# EAGLE design pure_class_a_dynamic (EAGLE 5.07)
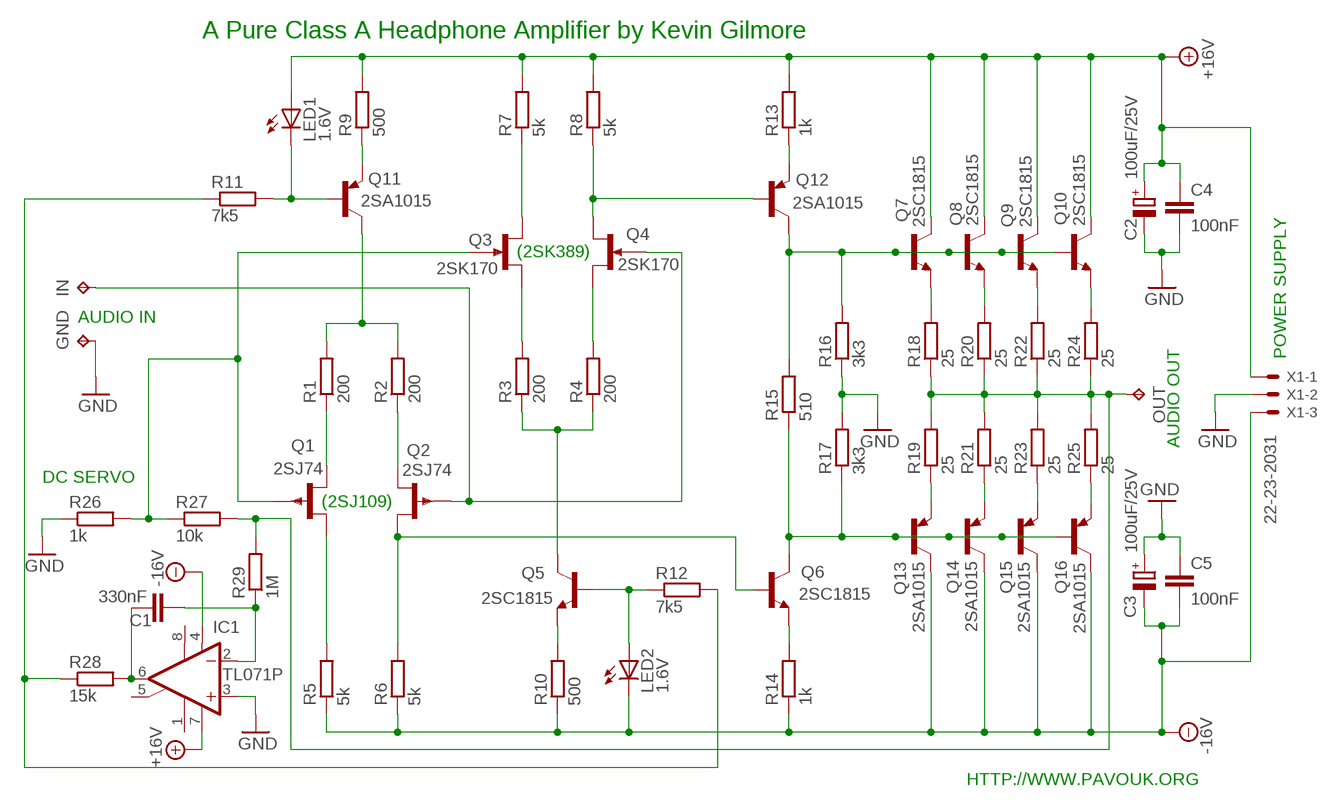
[diagram p0: schematic, sheet 1]

## Parts
C1  330nF  C-EU050-055X075  [C050-055X075]
C2  100uF/25V  CPOL-EUE3.5-8  [E3,5-8]
C3  100uF/25V  CPOL-EUE3.5-8  [E3,5-8]
C4  100nF  C-EU050-035X075  [C050-035X075]
C5  100nF  C-EU050-035X075  [C050-035X075]
GND  TPPAD1-20  [P1-20]
IC1  TL071P  [DIL08]
IN  TPPAD1-20  [P1-20]
LED1  1.6V  LEDSFH480  [SFH480]
LED2  1.6V  LEDSFH480  [SFH480]
OUT  TPPAD1-20  [P1-20]
Q1  2SJ74  2N3820  [TO92F]
Q2  2SJ74  2N3820  [TO92F]
Q3  2SK170  2N3819  [TO92F]
Q4  2SK170  2N3819  [TO92F]
Q5  2SC1815  [TO92-ECB]
Q6  2SC1815  [TO92-ECB]
Q7  2SC1815  [TO92-ECB]
Q8  2SC1815  [TO92-ECB]
Q9  2SC1815  [TO92-ECB]
Q10  2SC1815  [TO92-ECB]
Q11  2SA1015  -PNP-TO92-ECB  [TO92-ECB]
Q12  2SA1015  -PNP-TO92-ECB  [TO92-ECB]
Q13  2SA1015  -PNP-TO92-ECB  [TO92-ECB]
Q14  2SA1015  -PNP-TO92-ECB  [TO92-ECB]
Q15  2SA1015  -PNP-TO92-ECB  [TO92-ECB]
Q16  2SA1015  -PNP-TO92-ECB  [TO92-ECB]
R1  200  R-EU_0207/10  [0207/10]
R2  200  R-EU_0207/10  [0207/10]
R3  200  R-EU_0207/10  [0207/10]
R4  200  R-EU_0207/10  [0207/10]
R5  5k  R-EU_0207/10  [0207/10]
R6  5k  R-EU_0207/10  [0207/10]
R7  5k  R-EU_0207/10  [0207/10]
R8  5k  R-EU_0207/10  [0207/10]
R9  500  R-EU_0207/10  [0207/10]
R10  500  R-EU_0207/10  [0207/10]
R11  7k5  R-EU_0207/10  [0207/10]
R12  7k5  R-EU_0207/10  [0207/10]
R13  1k  R-EU_0207/10  [0207/10]
R14  1k  R-EU_0207/10  [0207/10]
R15  510  R-EU_0207/10  [0207/10]
R16  3k3  R-EU_0207/10  [0207/10]
R17  3k3  R-EU_0207/10  [0207/10]
R18  25  R-EU_0207/10  [0207/10]
R19  25  R-EU_0207/10  [0207/10]
R20  25  R-EU_0207/10  [0207/10]
R21  25  R-EU_0207/10  [0207/10]
R22  25  R-EU_0207/10  [0207/10]
R23  25  R-EU_0207/10  [0207/10]
R24  25  R-EU_0207/10  [0207/10]
R25  25  R-EU_0207/10  [0207/10]
R26  1k  R-EU_0207/10  [0207/10]
R27  10k  R-EU_0207/10  [0207/10]
R28  15k  R-EU_0207/10  [0207/10]
R29  1M  R-EU_0207/10  [0207/10]
X1  22-23-2031  [22-23-2031]

## Nets
+15V: C2.+ C4.1 IC1.7(V+) LED1.A Q7.C Q8.C Q9.C Q10.C R7.2 R8.2 R9.2 R13.2 X1.1 ; supply symbol labelled +16V
-15V: C3.- C5.2 IC1.4(V-) LED2.K(C) Q13.C Q14.C Q15.C Q16.C R5.1 R6.1 R10.1 R14.1 X1.3 ; supply symbol labelled -16V
GND: C2.- C3.+ C4.2 C5.1 GND.TP IC1.3(+IN) R16.1 R17.2 R26.1 X1.2
N$1: OUT.TP R18.1 R19.2 R20.1 R21.2 R22.1 R23.2 R24.1 R25.2 R27.2 R29.2
N$2: Q7.E R18.2
N$3: Q8.E R20.2
N$4: Q9.E R22.2
N$5: Q10.E R24.2
N$6: Q13.E R19.1
N$7: Q14.E R21.1
N$8: Q15.E R23.1
N$9: Q16.E R25.1
N$10: Q11.E R9.1
N$11: Q7.B Q8.B Q9.B Q10.B Q12.C R15.2 R16.2
N$12: LED1.K(C) Q11.B R11.2
N$13: Q6.C Q13.B Q14.B Q15.B Q16.B R15.1 R17.1
N$14: Q12.E R13.1
N$15: Q6.E R14.2
N$16: Q5.E R10.2
N$17: LED2.A Q5.B R12.1
N$18: Q5.C R3.1 R4.1
N$19: Q3.D R7.1
N$20: Q3.S R3.2
N$21: Q4.D R4.2
N$22: Q4.S Q12.B R8.1
N$23: Q1.D R1.1
N$24: Q2.D Q6.B R6.2
N$25: Q2.S R2.1
N$26: Q1.S R5.2
N$27: Q11.C R1.2 R2.2
N$28: Q1.G Q3.G R26.2 R27.1
N$29: IN.TP Q2.G Q4.G
N$30: C1.1 IC1.6(OUT) R28.2
N$32: C1.2 IC1.2(-IN) R29.1
N$34: R11.1 R12.2 R28.1
Unconnected: IC1.1(ON1) IC1.5(ON2) IC1.8(OPT)

## Notes on the sheet
- A Pure Class A Headphone Amplifier by Kevin Gilmore
- (2SK389)
- AUDIO IN
- POWER SUPPLY
- AUDIO OUT
- DC SERVO
- (2SJ109)
- HTTP://WWW.PAVOUK.ORG

## Library data of the parts
C1 C4 C5 = rcl:C-EU: CAPACITOR, European symbol
C2 C3 = rcl:CPOL-EU: POLARIZED CAPACITOR, European symbol
GND IN OUT = testpad:TP: Test pad
IC1 = linear:TL071: OP AMP
LED1 LED2 = led:LED: LED OSRAM: - CHIPLED LG R971, LG N971, LY N971, LG Q971, LY Q971, LO R971, LY R971 LH N974, LH R974 LS Q976, LO Q976, LY Q976 LO Q996 - Hyper CHIPLED LW Q18S LB Q993, LB Q99A, LB R99A - SideLED LS A670, LO A670, LY A670, LG A670, LP A670 LB A673, LV A673, LT A673, LW A673 LH A674 LY A675 LS A676, LA A676, LO A676, LY A676, LW A676 LS A679, LY A679, LG A679 - Hyper Micro SIDELED® LS Y876, LA Y876, LO Y876, LY Y876 LT Y87S - SmartLED LW L88C, LW L88S LB L89C, LB L89S, LG L890 LS L89K, LO L89K, LY L89K LS L896, LA L896, LO L896, LY L896 - TOPLED LS T670, LO T670, LY T670, LG T670, LP T670 LSG T670, LSP T670, LSY T670, LOP T670, LYG T670 LG T671, LOG T671, LSG T671 LB T673, LV T673, LT T673, LW T673 LH T674 LS T676, LA T676, LO T676, LY T676, LB T676, LH T676, LSB T676, LW T676 LB T67C, LV T67C, LT T67C, LS T67K, LO T67K, LY T67K, LW E67C LS E67B, LA E67B, LO E67B, LY E67B, LB E67C, LV E67C, LT E67C LW T67C LS T679, LY T679, LG T679 LS T770, LO T770, LY T770, LG T770, LP T770 LB T773, LV T773, LT T773, LW T773 LH T774 LS E675, LA E675, LY E675, LS T675 LS T776, LA T776, LO T776, LY T776, LB T776 LHGB T686 LT T68C, LB T68C - Hyper Mini TOPLED® LB M676 - Mini TOPLED Santana® LG M470 LS M47K, LO M47K, LY M47K Source: http://www.osram.convergy.de LUXEON: - LUMILED® LXK2-PW12-R00, LXK2-PW12-S00, LXK2-PW14-U00, LXK2-PW14-V00 LXK2-PM12-R00, LXK2-PM12-S00, LXK2-PM14-U00 LXK2-PE12-Q00, LXK2-PE12-R00, LXK2-PE12-S00, LXK2-PE14-T00, LXK2-PE14-U00 LXK2-PB12-K00, LXK2-PB12-L00, LXK2-PB12-M00, LXK2-PB14-N00, LXK2-PB14-P00, LXK2-PB14-Q00 LXK2-PR12-L00, LXK2-PR12-M00, LXK2-PR14-Q00, LXK2-PR14-R00 LXK2-PD12-Q00, LXK2-PD12-R00, LXK2-PD12-S00 LXK2-PH12-R00, LXK2-PH12-S00 LXK2-PL12-P00, LXK2-PL12-Q00, LXK2-PL12-R00 Source: www.luxeon.com KINGBRIGHT: KA-3528ASYC Source: www.kingbright.com
Q1 Q2 = transistor-small-signal:2N3820: P-CHANNEL FET
Q3 Q4 = transistor-small-signal:2N3819: N-CHANNEL FET
Q5-Q10 = transistor:2SC1815: NPN EPITAXIAL TRANSISTOR Source: TOSHIBA .. 2SC1815 1.pdf
Q11-Q16 = transistor-neu-to92:*-PNP-: PNP Transistror
R1-R29 = rcl:R-EU_: RESISTOR, European symbol
X1 = con-molex:22-23-2031: .100" (2.54mm) Center Header - 3 Pin

## Board
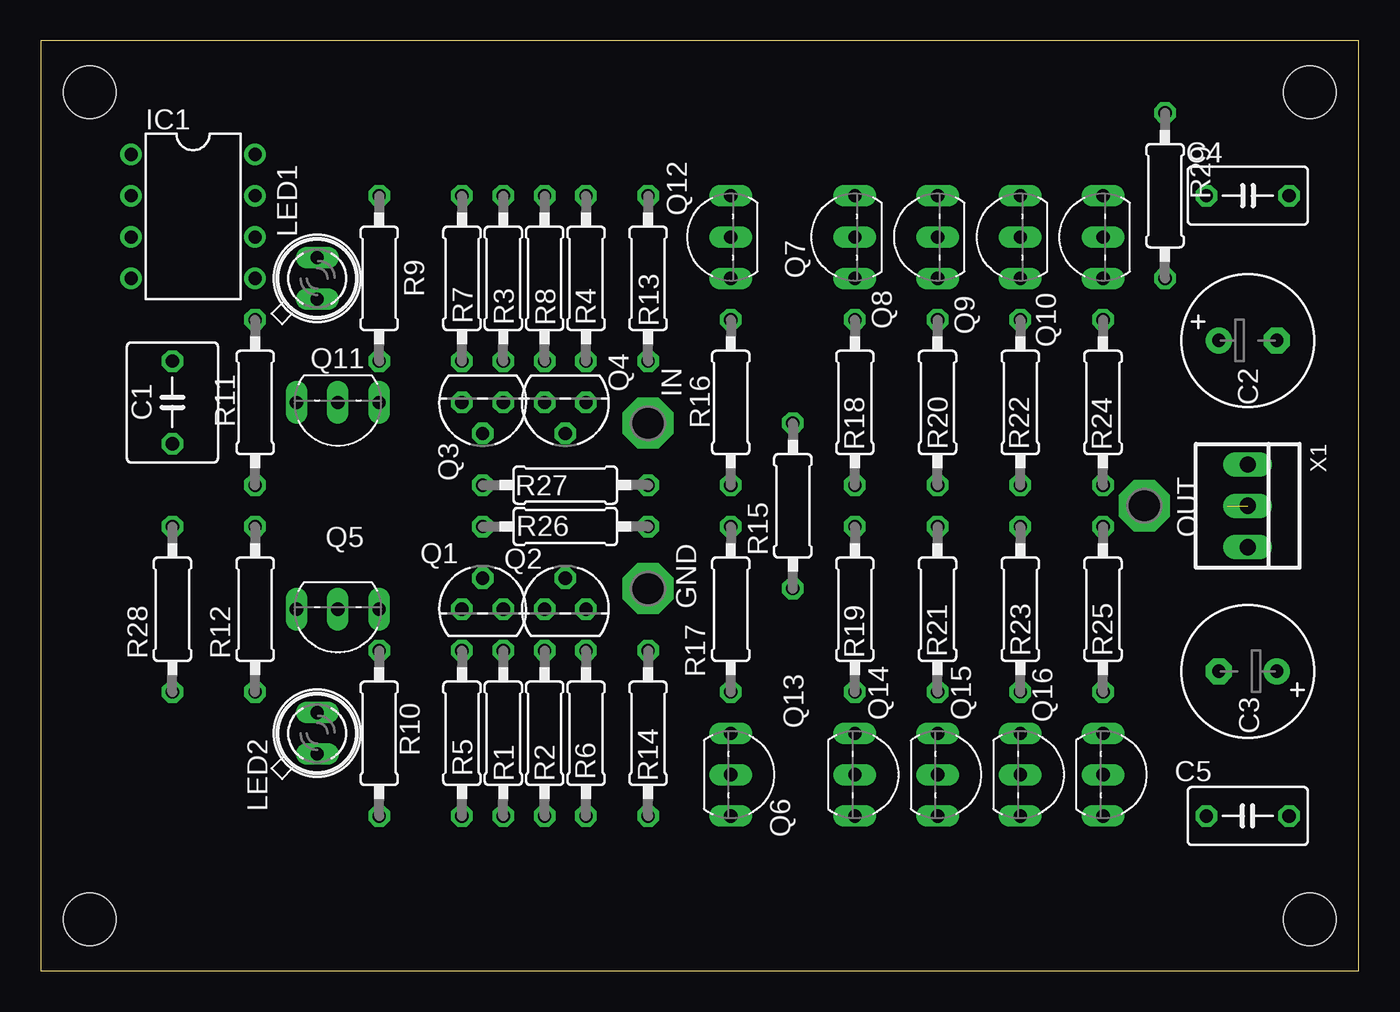
[diagram p1: board, top side]
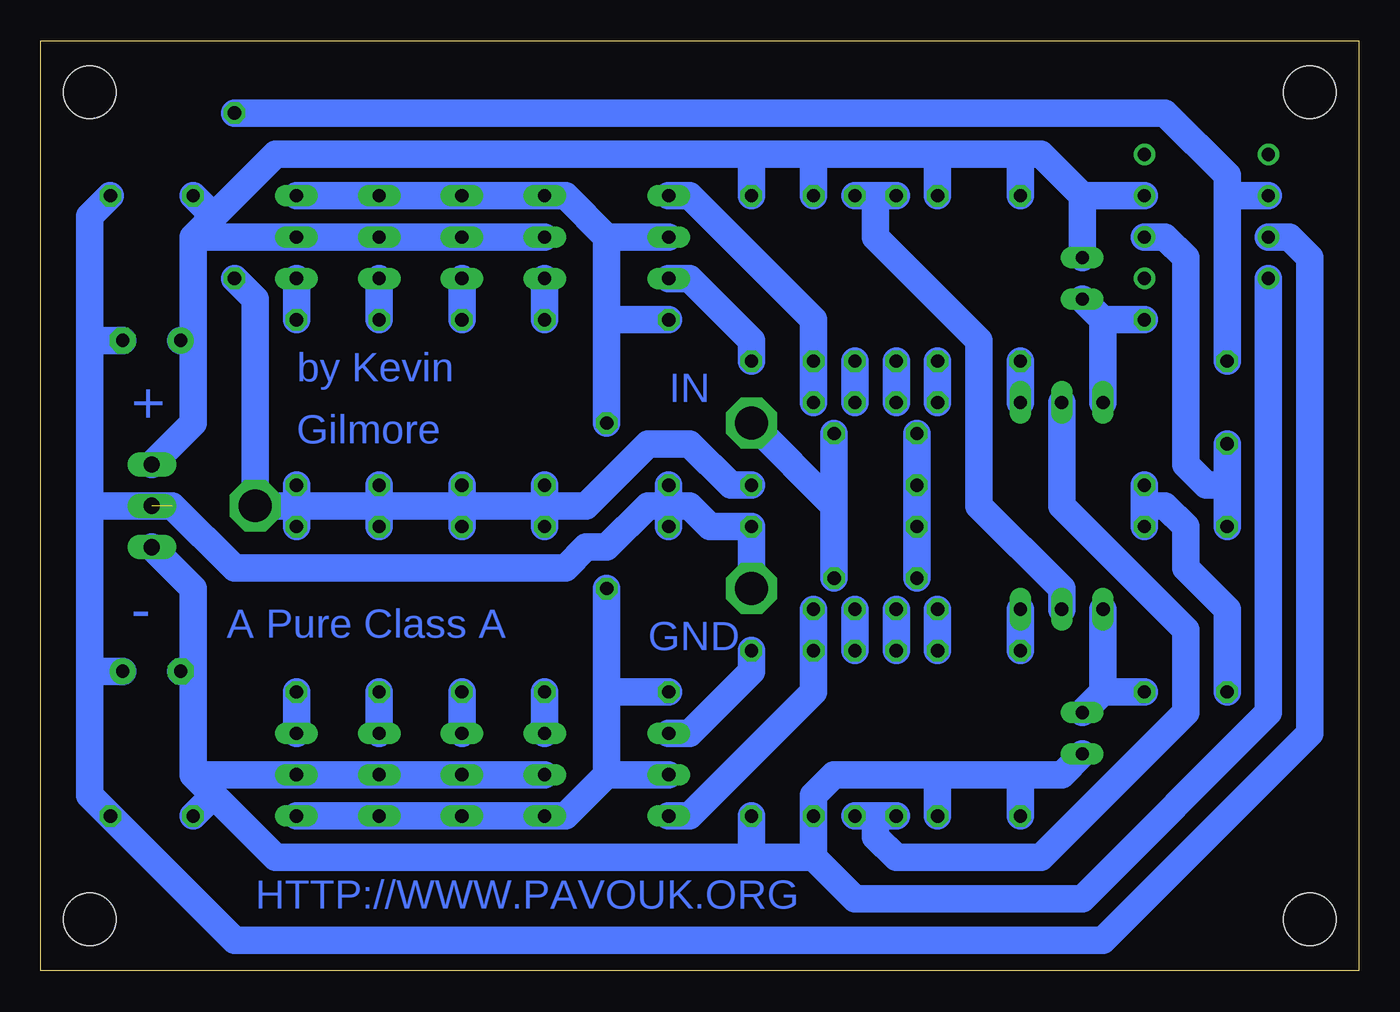
[diagram p2: board, bottom side, seen from below]

Size 80.95 x 57.14 mm. Coordinates in mm from the lower left corner, seen from the top.
Outline: 0,0 80.95,0 80.95,57.14 0,57.14 0,0
Copper layers (1*16): Top 0.035mm / dielectric 1.5mm / Bottom 0.035mm
Design rules "default": minimum track width 10mil, minimum drill 24mil, track to track 8mil, track to pad 8mil, pad to pad 8mil, via to via 8mil, smd to smd 8mil, copper to edge 40mil, drill to drill 8mil, minimum pad ring 10mil, minimum via ring 8mil, stop-mask expansion 4mil, vias tented up to drill 0mil, thermal gap 10mil
Holes 3.2 mm at 3.01,53.97 3.01,3.17 77.94,53.97 77.94,3.17

### Footprints (pad centres in the part's own frame; a part is rotated, then mirrored left to right if it is on the bottom)
C050-055X075 = drill 0.813 octagon: 1 -2.54,0; 2 2.54,0
E3,5-8 = drill 0.813 pad 1.6 round: + -1.778,0 | drill 0.813 pad 1.6 octagon: - 1.778,0
C050-035X075 = drill 0.813 octagon: 1 -2.54,0; 2 2.54,0
P1-20 = drill 2.007 pad 3.15 octagon: TP 0,0
DIL08 = drill 0.813 pad 1.27 round: 1 -3.81,-3.81; 2 -1.27,-3.81; 3 1.27,-3.81; 4 3.81,-3.81; 5 3.81,3.81; 6 1.27,3.81; 7 -1.27,3.81; 8 -3.81,3.81
SFH480 = drill 0.813 long: A 1.27,0; K -1.27,0
TO92F = drill 0.813 octagon: D 1.27,0; G 0,1.905; S -1.27,0
TO92-ECB = drill 0.813 long: B 2.54,0; C 0,0; E -2.54,0
0207/10 = drill 0.813 octagon: 1 -5.08,0; 2 5.08,0
22-23-2031 = drill 1 long: 1 -2.54,0; 2 0,0; 3 2.54,0

### Placement (x,y rotation side)
C1  8.09,34.92 90 top
C2  74.13,38.73 0 top
C3  74.13,18.41 180 top
C4  74.13,47.62 0 top
C5  74.13,9.52 180 top
GND  37.3,23.49 90 top
IC1  9.36,46.35 270 top
IN  37.3,33.65 90 top
LED1  16.98,42.54 90 top
LED2  16.98,14.6 90 top
OUT  67.78,28.57 270 top
Q1  27.14,22.22 0 top
Q2  32.22,22.22 0 top
Q3  27.14,34.92 180 top
Q4  32.22,34.92 180 top
Q5  18.25,22.22 180 top
Q6  42.38,12.06 270 top
Q7  50,45.08 90 top
Q8  55.08,45.08 90 top
Q9  60.16,45.08 90 top
Q10  65.24,45.08 90 top
Q11  18.25,34.92 180 top
Q12  42.38,45.08 90 top
Q13  50,12.06 270 top
Q14  55.08,12.06 270 top
Q15  60.16,12.06 270 top
Q16  65.24,12.06 270 top
R1  28.41,14.6 270 top
R2  30.95,14.6 270 top
R3  28.41,42.54 270 top
R4  30.95,42.54 270 top
R5  25.87,14.6 90 top
R6  33.49,14.6 90 top
R7  25.87,42.54 90 top
R8  33.49,42.54 90 top
R9  20.79,42.54 90 top
R10  20.79,14.6 90 top
R11  13.17,34.92 90 top
R12  13.17,22.22 90 top
R13  37.3,42.54 90 top
R14  37.3,14.6 90 top
R15  46.19,28.57 90 top
R16  42.38,34.92 90 top
R17  42.38,22.22 90 top
R18  50,34.92 90 top
R19  50,22.22 90 top
R20  55.08,34.92 90 top
R21  55.08,22.22 90 top
R22  60.16,34.92 90 top
R23  60.16,22.22 90 top
R24  65.24,34.92 90 top
R25  65.24,22.22 90 top
R26  32.22,27.3 180 top
R27  32.22,29.84 0 top
R28  8.09,22.22 90 top
R29  69.05,47.62 270 top
X1  74.13,28.57 270 top

### Tracks (layer width: path | path; a pad name or v marks a point on that pad's centre or on a via)
+15V
  Bottom 1.676: 37.3,50.16 R13.2 | 20.79,50.16 25.87,50.16 | 25.87,50.16 33.49,50.16 | 33.49,50.16 37.3,50.16 | 20.79,50.16 R9.2 | 16.98,47.62 IC1.7 | 16.98,47.62 19.52,50.16 20.79,50.16 | LED1.A 16.98,47.62 | Q7.C Q8.C Q9.C Q10.C 71.59,45.08 | 37.3,50.16 66.51,50.16 70.32,46.35 | 25.87,50.16 R7.2 | 33.49,50.16 R8.2 | 71.59,38.73 C2.+ | 71.59,45.08 71.59,38.73 | X1.1 71.59,33.65 71.59,38.73 | 70.32,46.35 71.59,45.08 | 70.32,46.35 C4.1
-15V
  Bottom 1.676: 37.3,6.98 R14.1 | 20.79,12.06 18.25,12.06 LED2.K | 25.87,12.06 20.79,12.06 | 25.87,12.06 32.22,12.06 33.49,10.79 R6.1 33.49,6.98 | 20.79,12.06 R10.1 | 25.87,12.06 R5.1 | 33.49,6.98 37.3,6.98 | 33.49,6.98 30.95,4.44 16.98,4.44 5.55,15.87 IC1.4 | 37.3,6.98 66.51,6.98 70.32,10.79 | Q13.C Q14.C Q15.C Q16.C 71.59,12.06 | 70.32,10.79 71.59,12.06 | X1.3 71.59,23.49 71.59,18.41 | 71.59,12.06 71.59,18.41 | 71.59,18.41 C3.- | 70.32,10.79 C5.2
GND  (1 unrouted)
  Bottom 1.676: 42.38,28.57 R17.2 | 42.38,28.57 R16.1 | GND.TP R26.1 39.84,27.3 41.11,28.57 42.38,28.57 | 42.38,28.57 43.65,28.57 46.19,26.03 47.46,26.03 48.73,24.76 69.05,24.76 72.86,28.57 77.94,28.57 | IC1.3 4.28,45.08 3.01,43.81 3.01,14.6 15.71,1.9 69.05,1.9 C5.1 77.94,10.79 77.94,18.41 | 77.94,28.57 77.94,18.41 | 77.94,18.41 C3.+ | 77.94,28.57 77.94,38.73 | 77.94,38.73 C2.- | C4.2 77.94,46.35 77.94,38.73
N$1
  Bottom 1.676: 50,28.57 R18.1 | 50,28.57 55.08,28.57 | 55.08,28.57 60.16,28.57 | 60.16,28.57 65.24,28.57 | 65.24,28.57 R24.1 | 65.24,28.57 R25.2 | 60.16,28.57 R23.2 | 60.16,28.57 R22.1 | 55.08,28.57 R20.1 | 55.08,28.57 R21.2 | 50,28.57 R19.2 | 65.24,28.57 OUT.TP 67.78,41.27 R29.2 | 50,28.57 47.46,28.57 43.65,32.38 41.11,32.38 38.57,29.84 R27.2
N$2
  Bottom 1.676: R18.2 Q7.E
N$3
  Bottom 1.676: R20.2 Q8.E
N$4
  Bottom 1.676: R22.2 Q9.E
N$5
  Bottom 1.676: R24.2 Q10.E
N$6
  Bottom 1.676: Q13.E R19.1
N$7
  Bottom 1.676: Q14.E R21.1
N$8
  Bottom 1.676: Q15.E R23.1
N$9
  Bottom 1.676: Q16.E R25.1
N$10
  Bottom 1.676: Q11.E R9.1
N$11
  Bottom 1.676: Q10.B Q9.B Q8.B Q7.B 48.73,47.62 46.19,45.08 | R15.2 46.19,40 | 46.19,40 46.19,45.08 | 46.19,40 R16.2 | 46.19,45.08 Q12.C
N$12
  Bottom 1.676: 15.71,40 LED1.K | Q11.B 15.71,40 | 15.71,40 R11.2
N$13
  Bottom 1.676: Q16.B Q15.B Q14.B Q13.B 48.73,9.52 46.19,12.06 | 46.19,12.06 46.19,17.14 | 46.19,17.14 R15.1 | 46.19,17.14 R17.1 | Q6.C 46.19,12.06
N$14
  Bottom 1.676: R13.1 37.3,38.73 41.11,42.54 Q12.E
N$15
  Bottom 1.676: Q6.E 41.11,14.6 37.3,18.41 R14.2
N$16
  Bottom 1.676: R10.2 Q5.E
N$17
  Bottom 1.676: 15.71,17.14 Q5.B | 15.71,17.14 LED2.A | R12.1 15.71,17.14
N$18
  Bottom 1.676: Q5.C 18.25,23.49 23.33,28.57 23.33,38.73 29.68,45.08 29.68,47.62 | 29.68,47.62 R3.1 | 29.68,47.62 R4.1
N$19
  Bottom 1.676: Q3.D R7.1
N$20
  Bottom 1.676: Q3.S R3.2
N$21
  Bottom 1.676: Q4.D R4.2
N$22
  Bottom 1.676: Q4.S R8.1 33.49,40 41.11,47.62 Q12.B
N$23
  Bottom 1.676: R1.1 Q1.D
N$24
  Bottom 1.676: Q2.D R6.2 33.49,17.14 41.11,9.52 Q6.B
N$25
  Bottom 1.676: R2.1 Q2.S
N$26
  Bottom 1.676: R5.2 Q1.S
N$27
  Bottom 1.676: 29.68,9.52 R1.2 | 29.68,9.52 R2.2 | Q11.C 18.25,28.57 10.63,20.95 10.63,15.87 19.52,6.98 28.41,6.98 29.68,8.25 29.68,9.52
N$28
  Bottom 1.676: Q1.G R26.2 R27.1 Q3.G
N$29
  Bottom 1.676: Q2.G 32.22,28.57 | 32.22,28.57 Q4.G | 32.22,28.57 IN.TP
N$30
  Bottom 1.676: IC1.6 11.9,45.08 10.63,43.81 10.63,31.11 9.36,29.84 8.09,29.84 | R28.2 8.09,29.84 | 8.09,29.84 C1.1
N$32
  Bottom 1.676: 8.09,47.62 IC1.2 | R29.1 11.9,52.7 8.09,48.89 8.09,47.62 | C1.2 8.09,47.62
N$34
  Bottom 1.676: 13.17,28.57 R12.2 | 13.17,28.57 R11.1 | 13.17,28.57 11.9,28.57 10.63,27.3 10.63,24.76 8.09,22.22 R28.1

### Text on the board
Bottom: by Kevin | IN | + | Gilmore | A Pure Class A | - | GND | HTTP://WWW.PAVOUK.ORG